# EAGLE design encoders (EAGLE 9.3.2)
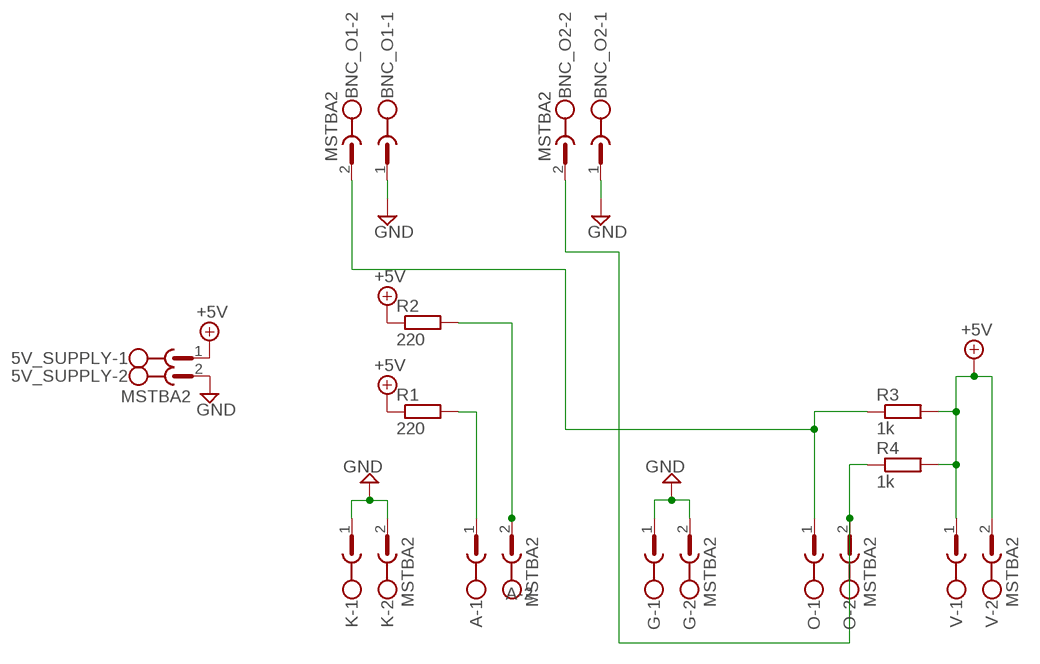
[diagram p0: schematic, sheet 1]

## Parts
5V_SUPPLY  MSTBA2  [MSTBA2]
A  MSTBA2  [MSTBA2]
BNC_O1  MSTBA2  [MSTBA2]
BNC_O2  MSTBA2  [MSTBA2]
G  MSTBA2  [MSTBA2]
K  MSTBA2  [MSTBA2]
O  MSTBA2  [MSTBA2]
R1  220  R-EU_0204/7  [0204/7]
R2  220  R-EU_0204/7  [0204/7]
R3  1k  R-EU_0204/7  [0204/7]
R4  1k  R-EU_0204/7  [0204/7]
V  MSTBA2  [MSTBA2]

## Nets
+5V: 5V_SUPPLY.1 R1.1 R2.1 R3.2 R4.2 V.1 V.2
GND: 5V_SUPPLY.2 BNC_O1.1 BNC_O2.1 G.1 G.2 K.1 K.2
N$1: A.1 R1.2
N$2: A.2 R2.2
N$3: BNC_O2.2 O.2 R4.1
N$4: BNC_O1.2 O.1 R3.1

## Library data of the parts
5V_SUPPLY A BNC_O1 BNC_O2 G K O V = con-phoenix-508:MSTBA2: PHOENIX; MF: FARNELL; MPN: 1757242; OC_FARNELL: 3705171; OC_NEWARK: 71C4161
R1-R4 = rcl:R-EU_: RESISTOR, European symbol; SPICEPREFIX: R

## Board
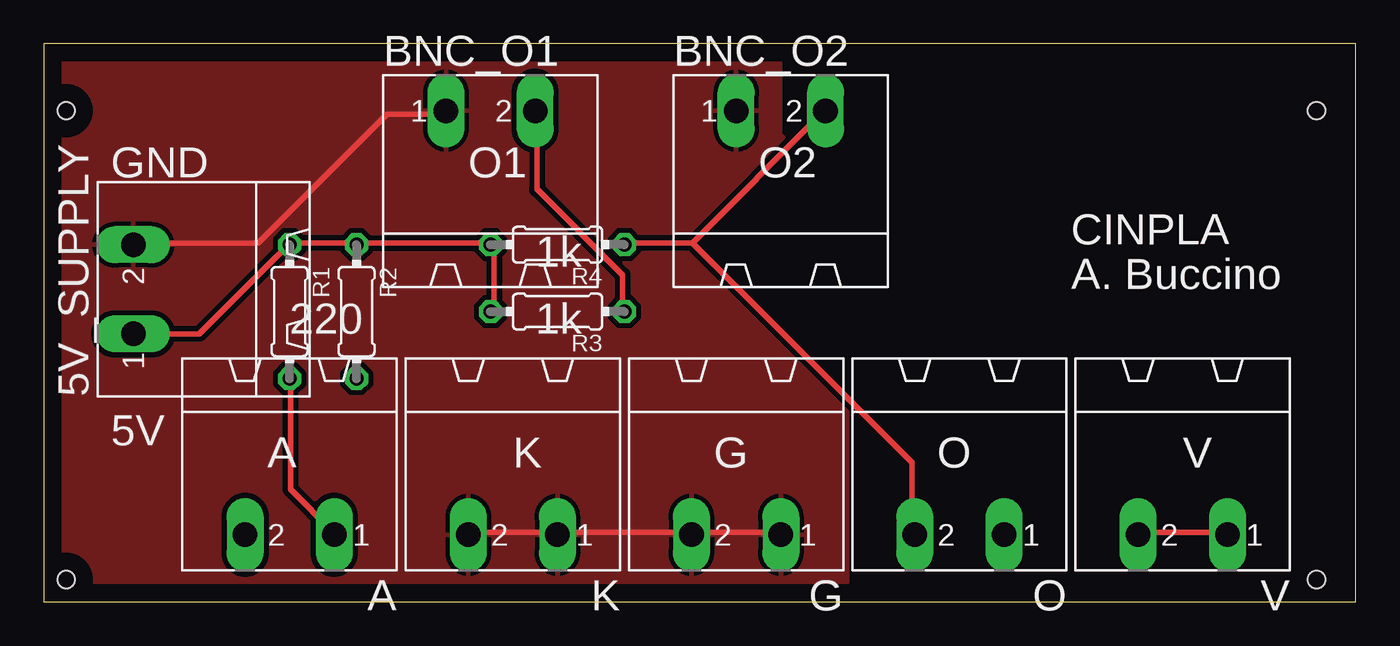
[diagram p1: board, top side]
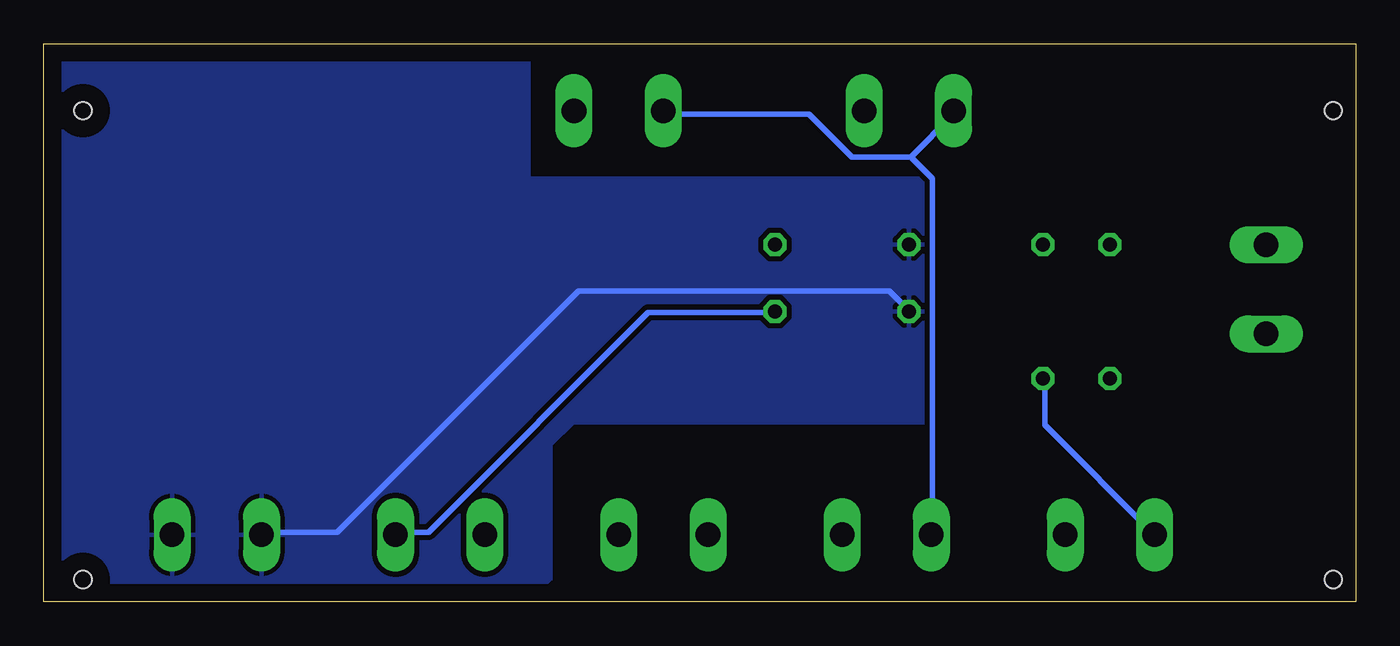
[diagram p2: board, bottom side, seen from below]

Size 74.6 x 31.74 mm. Coordinates in mm from the lower left corner, seen from the top.
Outline: 0,0 74.6,0 74.6,31.74 0,31.74 0,0
Copper layers (1*16): Top 0.035mm / dielectric 1.5mm / Bottom 0.035mm
Design rules "default *": minimum track width 12mil, minimum drill 0.35mm, track to track 12mil, track to pad 12mil, pad to pad 12mil, via to via 12mil, smd to smd 6mil, copper to edge 40mil, drill to drill 6mil, minimum pad ring 10mil, minimum via ring 8mil, stop-mask expansion 4mil, vias tented up to drill 0mil, thermal gap 10mil
Holes 1 mm at 1.27,27.94 72.39,27.94 1.27,1.27 72.39,1.27

### Footprints (pad centres in the part's own frame; a part is rotated, then mirrored left to right if it is on the bottom)
MSTBA2 = drill 1.397 long: 1 -2.54,5.08; 2 2.54,5.08
0204/7 = drill 0.813 octagon: 1 -3.81,0; 2 3.81,0

### Placement (x,y rotation side)
5V_SUPPLY  10.16,17.78 90 top
A  13.97,8.89 180 top
BNC_O1  25.4,22.86 0 top
BNC_O2  41.91,22.86 0 top
G  39.37,8.89 180 top
K  26.67,8.89 180 top
O  52.07,8.89 180 top
R1  13.97,16.51 270 top
R2  17.78,16.51 270 top
R3  29.21,16.51 180 top
R4  29.21,20.32 180 top
V  64.77,8.89 180 top

### Tracks (layer width: path | path; a pad name or v marks a point on that pad's centre or on a via)
+5V
  Top 0.305: V.2 62.48,3.96 67.06,3.96 V.1 | R3.2 25.6,16.76 25.6,20.12 R4.2 25.3,20.42 17.98,20.42 R2.1 17.68,20.42 14.02,20.42 R1.1 13.72,20.12 8.84,15.24 5V_SUPPLY.1
  Bottom 0.305: V.2 62.18,3.96 57.91,3.96 44.2,17.68 26.52,17.68 25.6,16.76 R3.2
  pour Bottom: 74.93,0 46.99,0 45.72,1.27 45.72,8.89 44.45,10.16 24.13,10.16 24.13,24.13 46.99,24.13 46.99,31.75 74.93,31.75
GND
  Top 0.305: K.2 24.38,3.96 28.96,3.96 K.1 29.26,3.96 36.58,3.96 G.2 36.88,3.96 41.76,3.96 G.1 | 5V_SUPPLY.2 5.18,20.42 12.19,20.42 19.51,27.74 22.86,27.74 BNC_O1.1
  Bottom 0.305: 25.3,25.3 28.65,25.3 31.09,27.74 39.32,27.74 BNC_O2.1 | 25.3,25.3 22.86,27.74 BNC_O1.1 | 25.3,25.3 24.08,24.08 24.08,3.96 K.2
  pour Top: 0,31.75 0,0 45.72,0 45.72,22.86 41.91,26.67 41.91,31.75
N$1
  Top 0.305: R1.2 14.02,12.5 14.02,6.4 16.46,3.96 A.1
N$2
  Bottom 0.305: A.2 17.68,10.06 17.68,12.5 R2.2
N$3
  Top 0.305: 36.88,20.42 33.22,20.42 R4.1 | 36.88,20.42 44.2,27.74 BNC_O2.2 | 36.88,20.42 49.38,7.92 49.38,3.96 O.2
N$4
  Top 0.305: R3.1 32.92,16.76 32.92,18.59 28.04,23.47 28.04,27.74 BNC_O1.2
  Bottom 0.305: O.1 54.56,3.96 52.73,3.96 40.23,16.46 33.22,16.46 R3.1

### Text on the board
tPlace: GND | O1 | O2 | CINPLA | 1k | A. Buccino | 220 | 1k | 5V | A | K | G | O | V